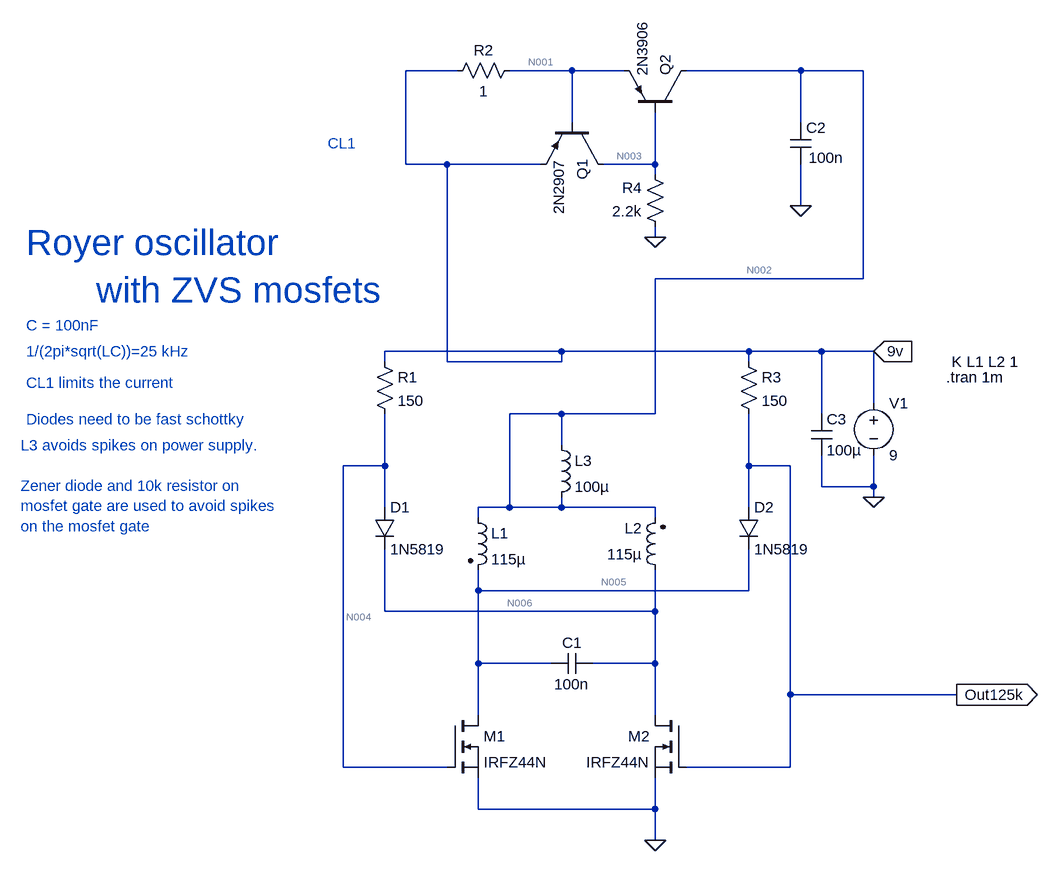
[diagram p0: schematic Metal_Royer-zvs.asc]
Metal_Royer-zvs.asc, the LTspice schematic file:
Version 4.1
SHEET 1 2912 788
WIRE 112 -416 32 -416
WIRE 288 -416 192 -416
WIRE 368 -416 288 -416
WIRE 640 -416 464 -416
WIRE 736 -416 640 -416
WIRE 288 -336 288 -416
WIRE 640 -336 640 -416
WIRE 32 -272 32 -416
WIRE 96 -272 32 -272
WIRE 240 -272 96 -272
WIRE 416 -272 416 -352
WIRE 416 -272 336 -272
WIRE 416 -256 416 -272
WIRE 640 -208 640 -272
WIRE 416 -160 416 -176
WIRE 736 -96 736 -416
WIRE 736 -96 416 -96
WIRE 272 16 0 16
WIRE 560 16 272 16
WIRE 672 16 560 16
WIRE 752 16 672 16
WIRE 0 32 0 16
WIRE 96 32 96 -272
WIRE 272 32 272 16
WIRE 272 32 96 32
WIRE 560 32 560 16
WIRE 752 96 752 16
WIRE 272 112 192 112
WIRE 416 112 416 -96
WIRE 416 112 272 112
WIRE 672 112 672 16
WIRE 272 160 272 112
WIRE 0 192 0 112
WIRE 0 192 -64 192
WIRE 560 192 560 112
WIRE 624 192 560 192
WIRE 672 224 672 176
WIRE 752 224 752 176
WIRE 752 224 672 224
WIRE 752 240 752 224
WIRE 0 256 0 192
WIRE 192 256 192 112
WIRE 192 256 144 256
WIRE 272 256 272 240
WIRE 272 256 192 256
WIRE 416 256 272 256
WIRE 560 256 560 192
WIRE 144 272 144 256
WIRE 416 272 416 256
WIRE 144 384 144 352
WIRE 560 384 560 320
WIRE 560 384 144 384
WIRE 0 416 0 320
WIRE 416 416 416 352
WIRE 416 416 0 416
WIRE 144 496 144 384
WIRE 256 496 144 496
WIRE 416 496 416 416
WIRE 416 496 320 496
WIRE 624 544 624 192
WIRE 880 544 624 544
WIRE 144 576 144 496
WIRE 416 576 416 496
WIRE -64 656 -64 192
WIRE 96 656 -64 656
WIRE 624 656 624 544
WIRE 624 656 464 656
WIRE 144 720 144 672
WIRE 416 720 416 672
WIRE 416 720 144 720
WIRE 416 768 416 720
FLAG 416 768 0
FLAG 752 240 0
FLAG 416 -160 0
FLAG 640 -208 0
FLAG 880 544 Out125k
IOPIN 880 544 Out
FLAG 752 16 9v
IOPIN 752 16 In
SYMBOL res -16 16 R0
SYMATTR InstName R1
SYMATTR Value 150
SYMBOL res 544 16 R0
SYMATTR InstName R3
SYMATTR Value 150
SYMBOL ind2 128 256 R0
SYMATTR InstName L1
SYMATTR Value 115µ
SYMATTR Type ind
SYMBOL ind2 432 368 R180
WINDOW 0 36 80 Left 2
WINDOW 3 36 40 Left 2
SYMATTR InstName L2
SYMATTR Value 115µ
SYMATTR Type ind
SYMBOL ind 256 144 R0
SYMATTR InstName L3
SYMATTR Value 100µ
SYMBOL cap 320 480 R90
WINDOW 0 0 32 VBottom 2
WINDOW 3 32 32 VTop 2
SYMATTR InstName C1
SYMATTR Value 100n
SYMBOL diode -16 256 R0
SYMATTR InstName D1
SYMATTR Value 1N5819
SYMBOL diode 544 256 R0
SYMATTR InstName D2
SYMATTR Value 1N5819
SYMBOL nmos 96 576 R0
SYMATTR InstName M1
SYMATTR Value IRFZ44N
SYMBOL nmos 464 576 M0
SYMATTR InstName M2
SYMATTR Value IRFZ44N
SYMBOL voltage 752 80 R0
WINDOW 123 0 0 Left 0
WINDOW 39 0 0 Left 0
SYMATTR InstName V1
SYMATTR Value 9
SYMBOL pnp 336 -336 R90
SYMATTR InstName Q1
SYMATTR Value 2N2907
SYMBOL pnp 464 -352 M270
SYMATTR InstName Q2
SYMATTR Value 2N3906
SYMBOL res 208 -432 R90
WINDOW 0 0 56 VBottom 2
WINDOW 3 32 56 VTop 2
SYMATTR InstName R2
SYMATTR Value 1
SYMBOL res 432 -160 R180
WINDOW 0 36 76 Left 2
WINDOW 3 36 40 Left 2
SYMATTR InstName R4
SYMATTR Value 2.2k
SYMBOL cap 624 -336 R0
WINDOW 3 28 54 Left 2
SYMATTR InstName C2
SYMATTR Value 100n
SYMBOL cap 656 112 R0
SYMATTR InstName C3
SYMATTR Value 100µ
TEXT 864 56 Left 2 !.tran 1m
TEXT 872 32 Left 2 !K L1 L2 1
TEXT -552 -24 Left 2 ;C = 100nF
TEXT -552 16 Left 2 ;1/(2pi*sqrt(LC))=25 kHz
TEXT -552 64 Left 2 ;CL1 limits the current
TEXT -552 -152 Left 5 ;Royer oscillator \n       with ZVS mosfets
TEXT -552 120 Left 2 ;Diodes need to be fast schottky
TEXT -560 160 Left 2 ;L3 avoids spikes on power supply.\n \nZener diode and 10k resistor on \nmosfet gate are used to avoid spikes\non the mosfet gate
TEXT -88 -304 Left 2 ;CL1

The netlist it stands for:
* Metal_Royer-zvs.asc
R1 9v N004 150
R3 9v Out125k 150
L1 N002 N005 115µ
L2 N006 N002 115µ
L3 N002 N002 100µ
C1 N006 N005 100n
D1 N004 N006 1N5819
D2 Out125k N005 1N5819
M1 N005 N004 0 0 IRFZ44N
M2 N006 Out125k 0 0 IRFZ44N
V1 9v 0 9
Q1 N003 N001 9v 0 2N2907
Q2 N002 N003 N001 0 2N3906
R2 N001 9v 1
R4 0 N003 2.2k
C2 N002 0 100n
C3 9v 0 100µ
.model D D
.lib standard.dio
.model NPN NPN
.model PNP PNP
.lib standard.bjt
.model NMOS NMOS
.model PMOS PMOS
.lib standard.mos
.tran 1m
K L1 L2 1
* C = 100nF
* 1/(2pi*sqrt(LC))=25 kHz
* CL1 limits the current
* Royer oscillator
*        with ZVS mosfets
* Diodes need to be fast schottky
* L3 avoids spikes on power supply.
* Zener diode and 10k resistor on
* mosfet gate are used to avoid spikes
* on the mosfet gate
* CL1
.backanno
.end

* Results of the author's LTspice run, read from the files saved beside the schematic
* Operating Point, zero values left out:
*   V(n004) = 4.128 V
*   V(n002) = 3.881 V
*   V(n005) = 3.881 V
*   V(n003) = 7.685 V
*   V(9v) = 9 V
*   V(out125k) = 4.128 V
*   V(n006) = 3.881 V
*   V(n001) = 8.617 V
*   I(V1) = -447.6 mA
*   Ic(Q2) = -379.2 mA
*   Ib(Q2) = -3.493 mA
*   Ie(Q2) = 382.7 mA
*   I(R2) = -382.7 mA
*   I(R1) = 32.48 mA
*   I(L1) = 189.6 mA
*   I(D2) = 32.48 mA
*   I(R3) = 32.48 mA
*   I(L2) = -189.6 mA
*   Id(M1) = 222.1 mA
*   Is(M1) = -222.1 mA
*   Ic(Q1) = -26.86 nA
*   Ib(Q1) = -106.1 pA
*   Ie(Q1) = 26.97 nA
*   I(R4) = -3.493 mA
*   I(D1) = 32.48 mA
*   Id(M2) = 222.1 mA
*   Is(M2) = -222.1 mA
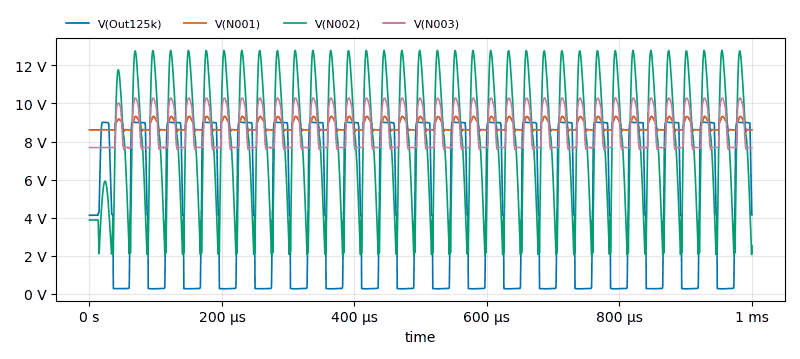
[diagram p1: Transient Analysis of Metal_Royer-zvs.asc, plotted from the saved traces]
* Transient Analysis, 1 run:
*   V(Out125k): min 265 mV, max 9.024 V, average 4.452 V, rms 6.048 V, last 4.147 V
*   V(N001): min 8.534 V, max 9.327 V, average 8.864 V, rms 8.869 V, last 8.614 V
*   V(N002): min 2.062 V, max 12.79 V, average 8.114 V, rms 8.788 V, last 2.536 V
*   V(N003): min 7.583 V, max 10.29 V, average 8.611 V, rms 8.681 V, last 7.681 V